# EasyEDA schematic 1-Schematic_STATIC FIRE CONTROLLER  Rev - 2.json
TITLE: Motor_Test_Monitor_Schematic Rev - 2; REV: 2.0; Date: 2025-10-23; Sheet: 1/1; Drawn By: gvsravan007; Company: VelR
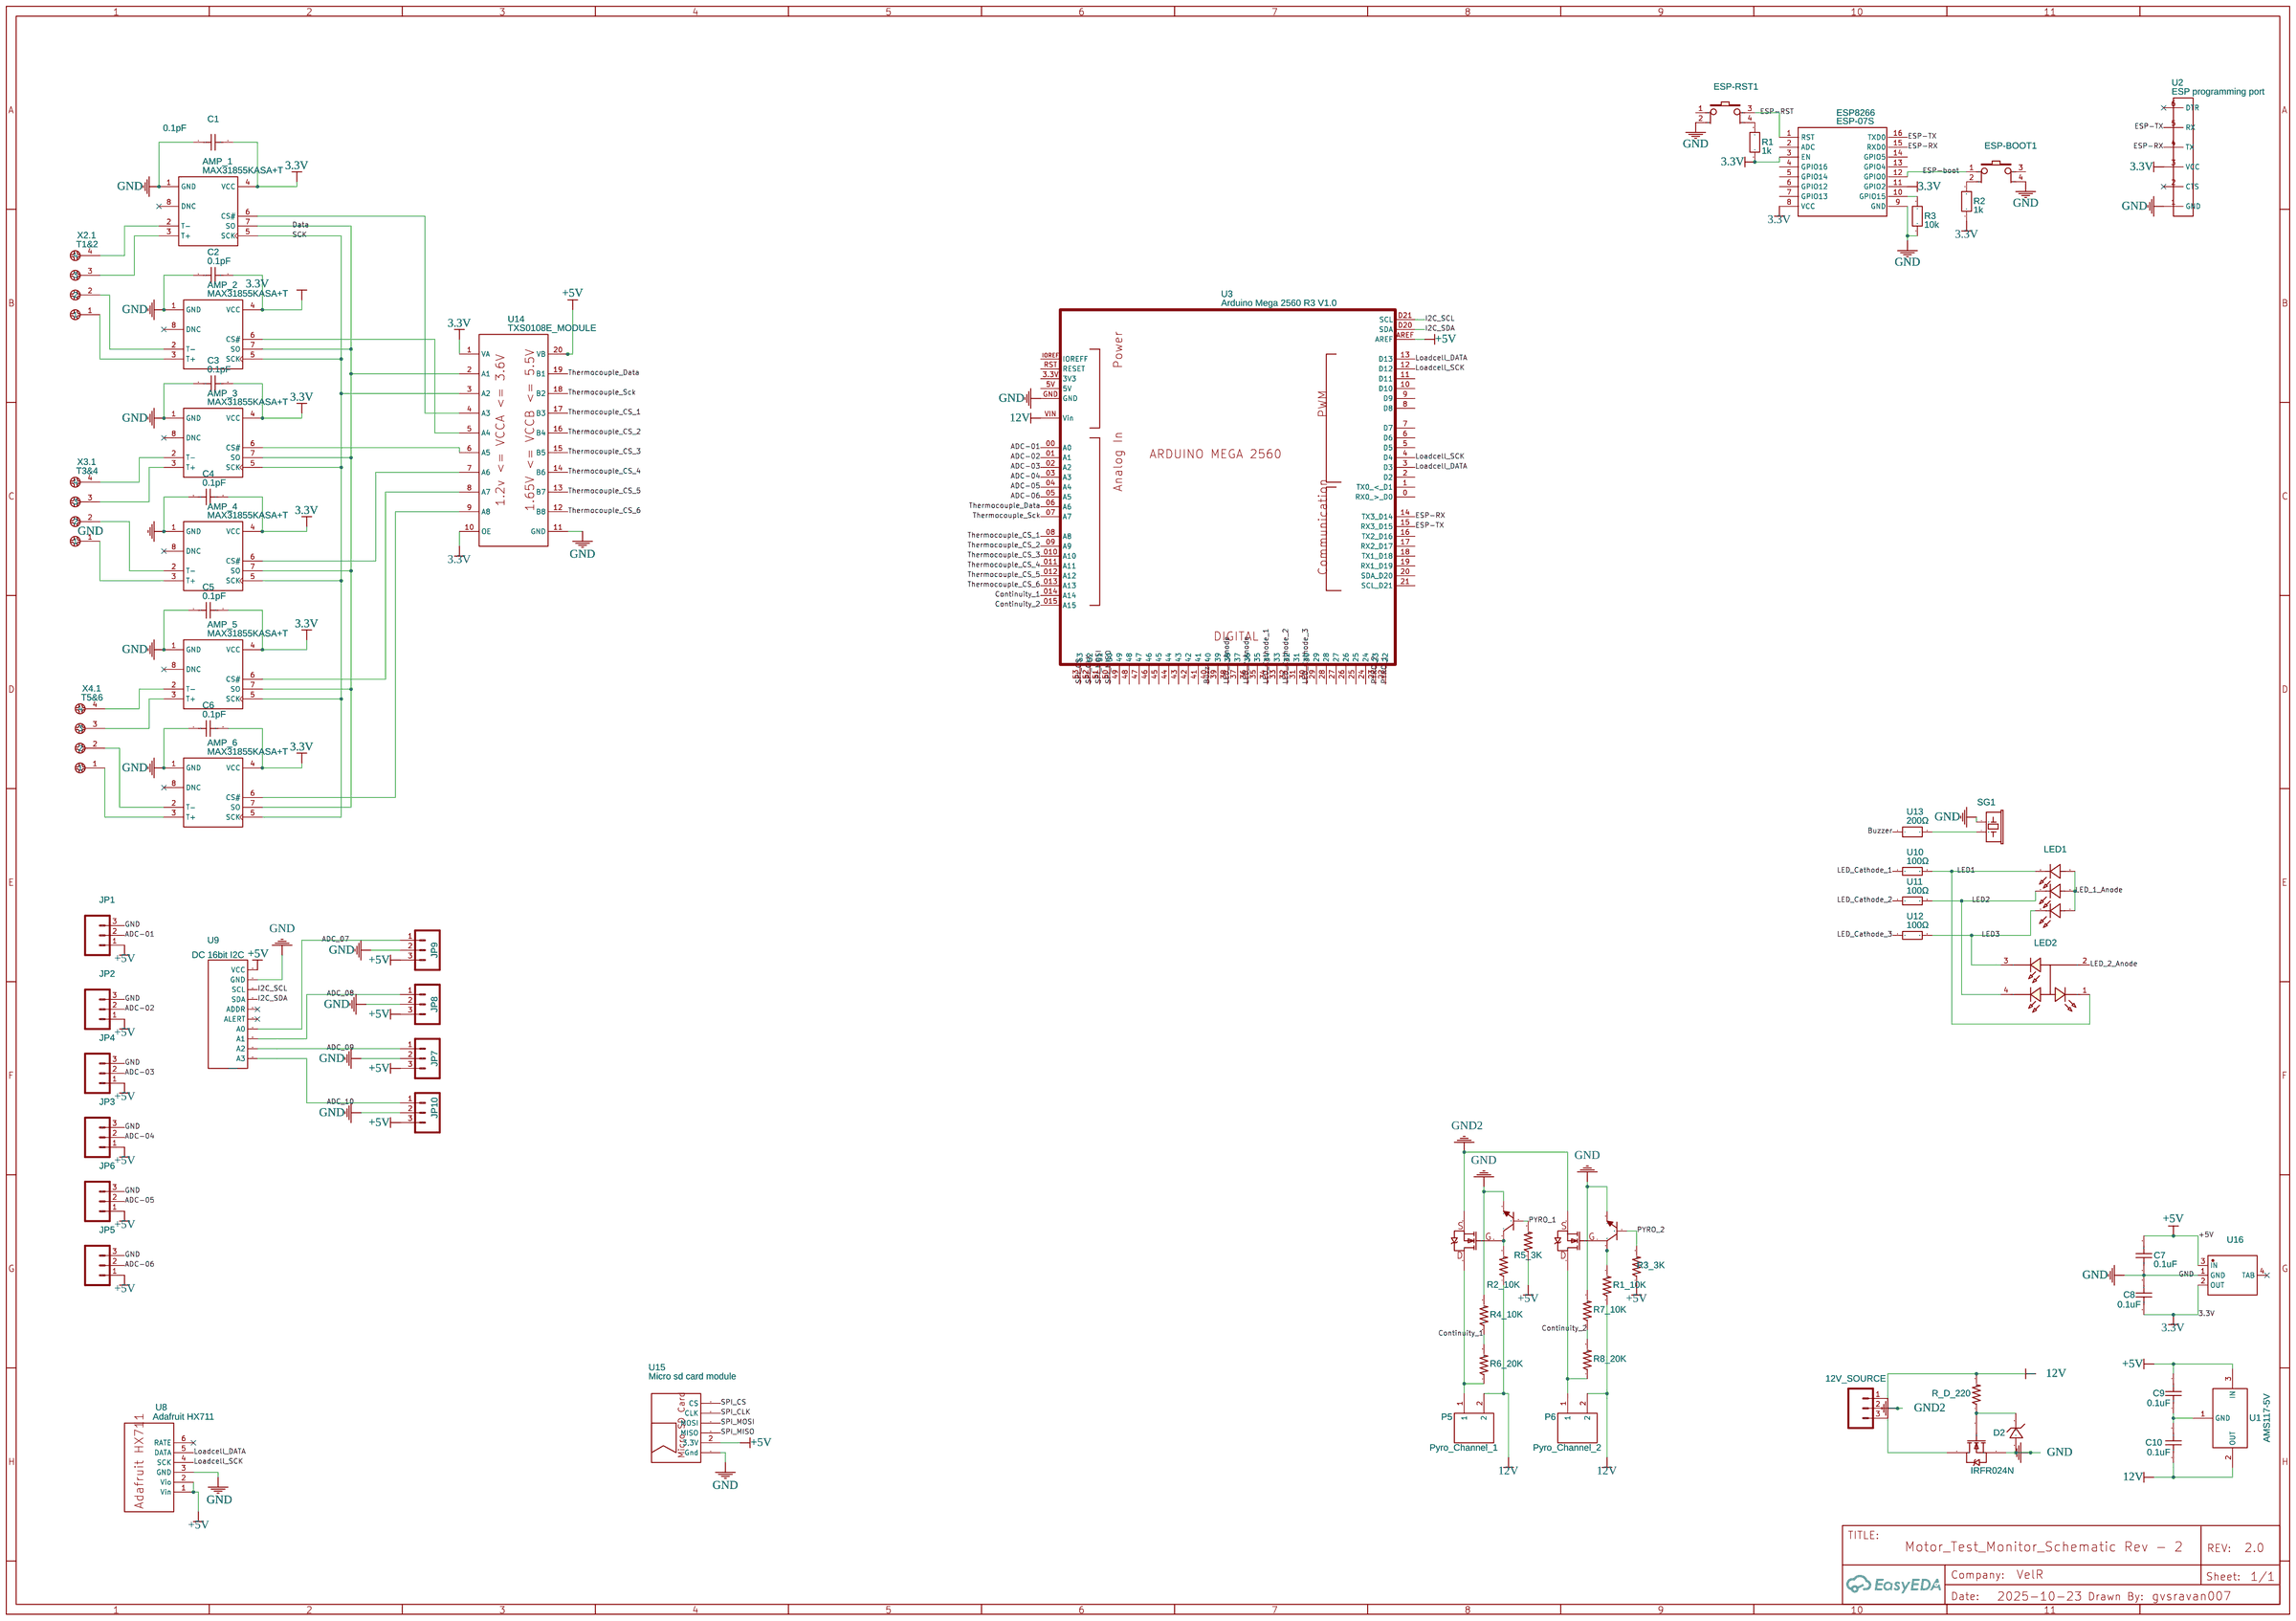
[diagram p0: schematic sheet]

## Parts
12V_SOURCE  seperate gnd  [SCREWTERMINAL-3.5MM-3_LOCK.007S]
AMP_1  MAX31855KASA+T  [SO-8_L4.9-W3.9-P1.27-LS5.9-BL]
AMP_2  MAX31855KASA+T  [SO-8_L4.9-W3.9-P1.27-LS5.9-BL]
AMP_3  MAX31855KASA+T  [SO-8_L4.9-W3.9-P1.27-LS5.9-BL]
AMP_4  MAX31855KASA+T  [SO-8_L4.9-W3.9-P1.27-LS5.9-BL]
AMP_5  MAX31855KASA+T  [SO-8_L4.9-W3.9-P1.27-LS5.9-BL]
AMP_6  MAX31855KASA+T  [SO-8_L4.9-W3.9-P1.27-LS5.9-BL]
C1  0.1pF  [C0603]
C2  0.1pF  [C0603]
C3  0.1pF  [C0603]
C4  0.1pF  [C0603]
C5  0.1pF  [C0603]
C6  0.1pF  [C0603]
C7  0.1uF  [C0603]
C8  0.1uF  [C0603]
C9  0.1uF  [C0603]
C10  0.1uF  [C0603]
CONTINUITY2  IRL 540N  [IRF540NTO-220AB-P3P81]
D2  1SMA4744A_C438363  [SMAF_L4.3-W2.5-LS5.0-RD]
ESP8266  ESP-07S  [ESP07S]
ESP-BOOT1  PUSH BUTTON 6*6*8.5  [KEY-TH_4P-L6.0-W6.0-P4.50]
ESP-RST1  PUSH BUTTON 6*6*8.5  [KEY-TH_4P-L6.0-W6.0-P4.50]
GND  IRL 540N  [IRF540NTO-220AB-P3P81]
IRFR024N  IRFR024N  [-TO-252AA_N]
JP1  M03JST-PTH  [JST-3-PTH]
JP2  M03JST-PTH  [JST-3-PTH]
JP3  M03JST-PTH  [JST-3-PTH]
JP4  M03JST-PTH  [JST-3-PTH]
JP5  M03JST-PTH  [JST-3-PTH]
JP6  M03JST-PTH  [JST-3-PTH]
JP7  M03JST-PTH  [JST-3-PTH]
JP8  M03JST-PTH  [JST-3-PTH]
JP9  M03JST-PTH  [JST-3-PTH]
JP10  M03JST-PTH  [JST-3-PTH]
LED1  XL-Z3535RGBA-SG  [LED-SMD_6P-L3.7W3.5-P1.10-BR]
LED2  XL-1615RGBC-RF  [LED-ARRAY-SMD_4P-L1.6-W1.5-BR_XL-1615RGBC-RF]
P5  Pyro_Channel_1  [TERMINALBLOCK_PHEONIX_PT-5.08MM_2POL]
P6  Pyro_Channel_2  [TERMINALBLOCK_PHEONIX_PT-5.08MM_2POL]
Q1  2N2222  [BJT FOOTPRINT _3D_MODEL]
Q2  2N2222  [BJT FOOTPRINT _3D_MODEL]
R1  1k  [RES-SMD_L3.2-W1.4]
R1_10K  RESISTORS_R_1W  [RES-SMD_L3.2-W1.4]
R2  1k  [RES-SMD_L3.2-W1.4]
R2_10K  RESISTORS_R_1W  [RES-SMD_L3.2-W1.4]
R3  10k  [RES-SMD_L3.2-W1.4]
R3_3K  3k  [RES-TH_BD2.4-L6.3-P10.30-D0.6]
R4_10K  RESISTORS_R_1W  [RES-SMD_L3.2-W1.4]
R5_3K  RESISTORS_R_1W  [RES-TH_BD2.4-L6.3-P10.30-D0.6]
R6_20K  RESISTORS_R_1W  [RES-TH_BD2.4-L6.3-P10.30-D0.6]
R7_10K  RESISTORS_R_1W  [RES-SMD_L3.2-W1.4]
R8_20K  RESISTORS_R_1W  [RES-TH_BD2.4-L6.3-P10.30-D0.6]
R_D_220  3k  [RES-TH_BD2.4-L6.3-P10.30-D0.6]
SG1  rrPiezo buzzer  [BUZZER-12MM-NS-KIT]
U1  AMS117-5V  [AMS117-TOPL]
U2  ESP programming port  [6 PIN HEADER DUPONT]
U3  Arduino Mega 2560 R3 V1.0  [TWIX_MEGA_PCB____ARDUINO-MEGA2560-FOOTPRINT_]
U8  Adafruit HX711  [ADAFRUIT HX711]
U9  DC 16bit I2C  [ADS115_MODUL]
U10  100Ω  [RES-TH_BD2.4-L6.3-P10.30-D0.6]
U11  100Ω  [RES-TH_BD2.4-L6.3-P10.30-D0.6]
U12  100Ω  [RES-TH_BD2.4-L6.3-P10.30-D0.6]
U13  200Ω  [RES-TH_BD2.4-L6.3-P10.30-D0.6]
U14  TXS0108E_MODULE  [TXS0108E_DRIVER_BREAKOUT_BOARD]
U15  Micro sd card module  [SD CARD MODULE W/ SD CARD]
U16  LM2937IMPX-2.5  [SOT-223-4_L6.5-W3.5-P2.30-LS7.0-BR]
X2  T1&2  [BARRIER_TERMINAL_7.5MM 4PIN]  (section 1)
X3  T3&4  [BARRIER_TERMINAL_7.5MM 4PIN]  (section 1)
X4  T5&6  [BARRIER_TERMINAL_7.5MM 4PIN]  (section 1)

## Library data of the parts
12V_SOURCE = M03SCREW_LOCK: Header 3; Contributor: SparkFun
AMP_1-AMP_6 = MAX31855KASA+T: Supplier: LCSC; Manufacturer: ADI(亚德诺)/MAXIM(美信); Supplier Part: C52028; JLCPCB Part Class: Extended Part
C1-C10 = VJ0603D0R1VXPAJ: Contributor: LCSC; Supplier: LCSC; Supplier Part: C2181339; Manufacturer: VISHAY(威世); JLCPCB Part Class: Extended Part
CONTINUITY2 GND = IRF540N: HEXFET Power MOSFET; Contributor: oliwia
D2 = 1SMA4744A_C438363: Contributor: LCSC; Supplier: LCSC; Supplier Part: C438363; Manufacturer: 晶导微电子; Manufacturer Part: 1SMA4744A; JLCPCB Part Class: Extended Part
ESP8266 = ESP-07S: Contributor: ujay
ESP-BOOT1 ESP-RST1 = PUSH BUTTON 6*6*8.5: Supplier Part: C59980; Supplier: LCSC; Manufacturer: ReliaPro; Manufacturer Part: button6*6*8.5; image: http://image.lceda.cn/szlcsc/C59980.jpg
IRFR024N = IRFR024N: HEXFET N-Channel Power MOSFET
JP1-JP10 = M03JST-PTH: Header 3; Contributor: SparkFun
LED1 = XL-Z3535RGBA-SG: Supplier: LCSC; Supplier Part: C22461787; Manufacturer: XINGLIGHT(成兴光); JLCPCB Part Class: Extended Part; Contributor: lcsc
LED2 = XL-1615RGBC-RF: Contributor: LCSC; Supplier: LCSC; Supplier Part: C965840; Manufacturer: XINGLIGHT(成兴光); JLCPCB Part Class: Extended Part
P5 P6 = TERMINAL_BLOCK_5.08MM_2POLE: Supplier Part: C8426; Supplier: LCSC; Manufacturer: ReliaPro; Contributor: RaspAutomacao
Q1 Q2 = 2N2222: Supplier: LCSC; Supplier Part: C358533; Manufacturer: Foshan Blue Rocket Elec; Manufacturer Part: 2N2222A; Contributor: LCSC; JLCPCB Part Class: Extended Part
R1-R3 = R_0603_EU: Contributor: LCEDA_Lib
R1_10K R2_10K R3_3K R4_10K R5_3K R6_20K R7_10K R8_20K R_D_220 = RESISTORS_R_1W: Contributor: Sevin7
SG1 = rrPiezo buzzer: Buzzer 12mm; Contributor: richard_at_nait
U1 = AMS117: Contributor: Achmad Purnomo
U2 = 6 pin Header dupont: Contributor: AmauryMaker
U3 = Arduino Mega 2560 R3 V1.0: Contributor: gvsravan007
U8 = Adafruit HX711: Contributor: gvsravan007
U9 = KENSHIN ADS1115 ADC 16bit I2C: Contributor: Mikimoto Aguillo
U10-U12 = YAGEO 100 OHM: Contributor: lcsc; Supplier: LCSC; Supplier Part: C1378349; Manufacturer: YAGEO(国巨); Manufacturer Part: RSF50SJT-PN100R
U13 = WHC200FET: Contributor: lcsc; Supplier: LCSC; Supplier Part: C3438475; Manufacturer: Ohmite; JLCPCB Part Class: Extended Part
U14 = TXS0108E_MODULE: Manufacturer Part: TXS0108E_BREAKOUT_BOARD; Contributor: kczarnom
U15 = Micro sd card module: Contributor: anisfligha
U16 = LM2937IMPX-2.5: Contributor: lcsc; Supplier: LCSC; Supplier Part: C3749724; Manufacturer: TI(德州仪器)
X2-X4 = Terminal_7.5mm 4PIN: Barrier Blocks Sreies 5202; Contributor: artit.p

## Nets
3.3V: AMP_1.4(VCC) AMP_2.4(VCC) AMP_3.4(VCC) AMP_4.4(VCC) AMP_5.4(VCC) AMP_6.4(VCC) C1.2 C2.2 C3.2 C4.2 C5.2 C6.2 C8.1 ESP8266.3(EN) ESP8266.8(VCC) ESP8266.11(GPIO2) R1.1 R2.1 U2.3(VCC) U14.1(VA) U14.10(OE) U16.2(OUT)
12V: 12V_SOURCE.1 C10.1 P5.2 P6.2 R1_10K.1 R2_10K.1 R_D_220.2 U1.2(OUT) U3.VIN(Vin)
+5V: C7.2 C9.2 JP1.1 JP2.1 JP3.1 JP4.1 JP5.1 JP6.1 JP7.3 JP8.3 JP9.3 JP10.3 R3_3K.1 R5_3K.1 U1.3(IN) U3.AREF U8.1(Vin) U8.2(Vio) U9.1(VCC) U14.20(VB) U15.2(3,3V) U16.3(IN)
GND: AMP_1.1(GND) AMP_2.1(GND) AMP_3.1(GND) AMP_4.1(GND) AMP_5.1(GND) AMP_6.1(GND) C1.1 C2.1 C3.1 C4.1 C5.1 C6.1 C7.1 C8.2 D2.2(A) ESP8266.9(GND) ESP-BOOT1.4 ESP-RST1.2 IRFR024N.3(S) JP1.3 JP2.3 JP3.3 JP4.3 JP5.3 JP6.3 JP7.2 JP8.2 JP9.2 JP10.2 Q1.1(E) Q2.1(E) R3.1 R4_10K.2 R7_10K.2 SG1.+(1) U2.1(GND) U3.GND U8.3(GND) U9.2(GND) U14.11(GND) U15.1(Gnd) U16.1(GND)
GND2: 12V_SOURCE.2 CONTINUITY2.3(S) GND.3(S)
ADC-01: JP1.2 U3.00(A0)
ADC-02: JP2.2 U3.01(A1)
ADC-03: JP4.2 U3.02(A2)
ADC-04: JP3.2 U3.03(A3)
ADC-05: JP6.2 U3.04(A4)
ADC-06: JP5.2 U3.05(A5)
ADC_07: JP9.1 U9.7(A0)
ADC_08: JP8.1 U9.8(A1)
ADC_09: JP7.1 U9.9(A2)
ADC_10: JP10.1 U9.10(A3)
Buzzer: U3.40 U13.1
Continuity_1: R4_10K.1 R6_20K.2 U3.014(A14)
Continuity_2: R7_10K.1 R8_20K.2 U3.015(A15)
Data: AMP_1.7(SO) AMP_2.7(SO) AMP_3.7(SO) AMP_4.7(SO) AMP_5.7(SO) AMP_6.7(SO) U14.2(A1)
ESP-boot: ESP8266.12(GPIO0) ESP-BOOT1.1
ESP-RST: ESP8266.1(RST) ESP-RST1.3
ESP-RX: ESP8266.15(RXD0) U2.4(TX) U3.14(TX3 D14)
ESP-TX: ESP8266.16(TXD0) U2.5(RX) U3.15(RX3 D15)
I2C_SCL: U3.D21(SCL) U9.3(SCL)
I2C_SDA: U3.D20(SDA) U9.4(SDA)
LED1: LED1.1(-) LED2.1(R-) U10.2
LED2: LED1.2(-) LED2.4(G-) U11.2
LED3: LED1.3(-) LED2.3(B-) U12.2
LED_1_Anode: LED1.4(+) LED1.5(+) LED1.6(+) U3.38
LED_2_Anode: LED2.2(COM+) U3.36
LED_Cathode_1: U3.34 U10.1
LED_Cathode_2: U3.32 U11.1
LED_Cathode_3: U3.30 U12.1
Loadcell_DATA: U3.3(D3) U3.13(D13) U8.5(DATA)
Loadcell_SCK: U3.4(D4) U3.12(D12) U8.4(SCK)
PYRO_1: Q1.2(B) R5_3K.2 U3.22
PYRO_2: Q2.2(B) R3_3K.2 U3.23
SCK: AMP_1.5(SCK) AMP_2.5(SCK) AMP_3.5(SCK) AMP_4.5(SCK) AMP_5.5(SCK) AMP_6.5(SCK) U14.3(A2)
SPI_CLK: U3.52 U15.5(CLK)
SPI_CS: U3.53 U15.6(CS)
SPI_MISO: U3.50 U15.3(MISO)
SPI_MOSI: U3.51 U15.4(MOSI)
Thermocouple_CS_1: U3.08(A8) U14.17(B3)
Thermocouple_CS_2: U3.09(A9) U14.16(B4)
Thermocouple_CS_3: U3.010(A10) U14.15(B5)
Thermocouple_CS_4: U3.011(A11) U14.14(B6)
Thermocouple_CS_5: U3.012(A12) U14.13(B7)
Thermocouple_CS_6: U3.013(A13) U14.12(B8)
Thermocouple_Data: U3.06(A6) U14.19(B1)
Thermocouple_Sck: U3.07(A7) U14.18(B2)
Net-(12V_SOURCE-3): 12V_SOURCE.3 IRFR024N.4(D)
Net-(AMP_1-2): AMP_1.2(T-) X2.4
Net-(AMP_1-3): AMP_1.3(T+) X2.3
Net-(AMP_1-6): AMP_1.6(CS#) U14.4(A3)
Net-(AMP_2-2): AMP_2.2(T-) X2.2
Net-(AMP_2-3): AMP_2.3(T+) X2.1
Net-(AMP_2-6): AMP_2.6(CS#) U14.5(A4)
Net-(AMP_3-2): AMP_3.2(T-) X3.4
Net-(AMP_3-3): AMP_3.3(T+) X3.3
Net-(AMP_3-6): AMP_3.6(CS#) U14.6(A5)
Net-(AMP_4-2): AMP_4.2(T-) X3.2
Net-(AMP_4-3): AMP_4.3(T+) X3.1
Net-(AMP_4-6): AMP_4.6(CS#) U14.7(A6)
Net-(AMP_5-2): AMP_5.2(T-) X4.4
Net-(AMP_5-3): AMP_5.3(T+) X4.3
Net-(AMP_5-6): AMP_5.6(CS#) U14.8(A7)
Net-(AMP_6-2): AMP_6.2(T-) X4.2
Net-(AMP_6-3): AMP_6.3(T+) X4.1
Net-(AMP_6-6): AMP_6.6(CS#) U14.9(A8)
Net-(C9-1): C9.1 C10.2 U1.1(GND)
Net-(CONTINUITY2-1): CONTINUITY2.1(G) Q2.3(C) R1_10K.2
Net-(CONTINUITY2-2): CONTINUITY2.2(D) R8_20K.1
Net-(D2-1): D2.1(C) IRFR024N.1(G) R_D_220.1
Net-(ESP8266-10): ESP8266.10(GPIO15) R3.2
Net-(ESP-BOOT1-2): ESP-BOOT1.2 R2.2
Net-(ESP-RST1-4): ESP-RST1.4 R1.2
Net-(GND-1): GND.1(G) Q1.3(C) R2_10K.2
Net-(GND-2): GND.2(D) P5.1 R6_20K.1
Net-(SG1--): SG1.-(2) U13.2

Not connected (* = marked no-connect by the designer): AMP_1 8(DNC)*; AMP_2 8(DNC)*; AMP_3 8(DNC)*; AMP_4 8(DNC)*; AMP_5 8(DNC)*; AMP_6 8(DNC)*; ESP8266 2(ADC) 4(GPIO16) 5(GPIO14) 6(GPIO12) 7(GPIO13) 13(GPIO4) 14(GPIO5); ESP-BOOT1 3; ESP-RST1 1; P6 1; U2 2(CTS)* 6(DTR)*; U3 0(RX0 > D0) 1(TX0 < D1) 2(D2) 3.3V(3V3) 5(D5) 5V 6(D6) 7(D7) 8(D8) 9(D9) 10(D10) 11(D11) 16(TX2 D16) 17(RX2 D17) 18(TX1 D18) 19(RX1 D19) 20(SDA D20) 21(SCL D21) 24 25 26 27 28 29 31 33 35 37 39 41 42 43 44 45 46 47 48 49 IOREF(IOREFF) RST(RESET); U8 6(RATE)*; U9 5(ADDR)* 6(ALERT)*; U16 4(TAB)*
